# Altium schematic sheet Shared.SchDoc
size OrCAD E; SheetNumber: 1; SheetTotal: 2
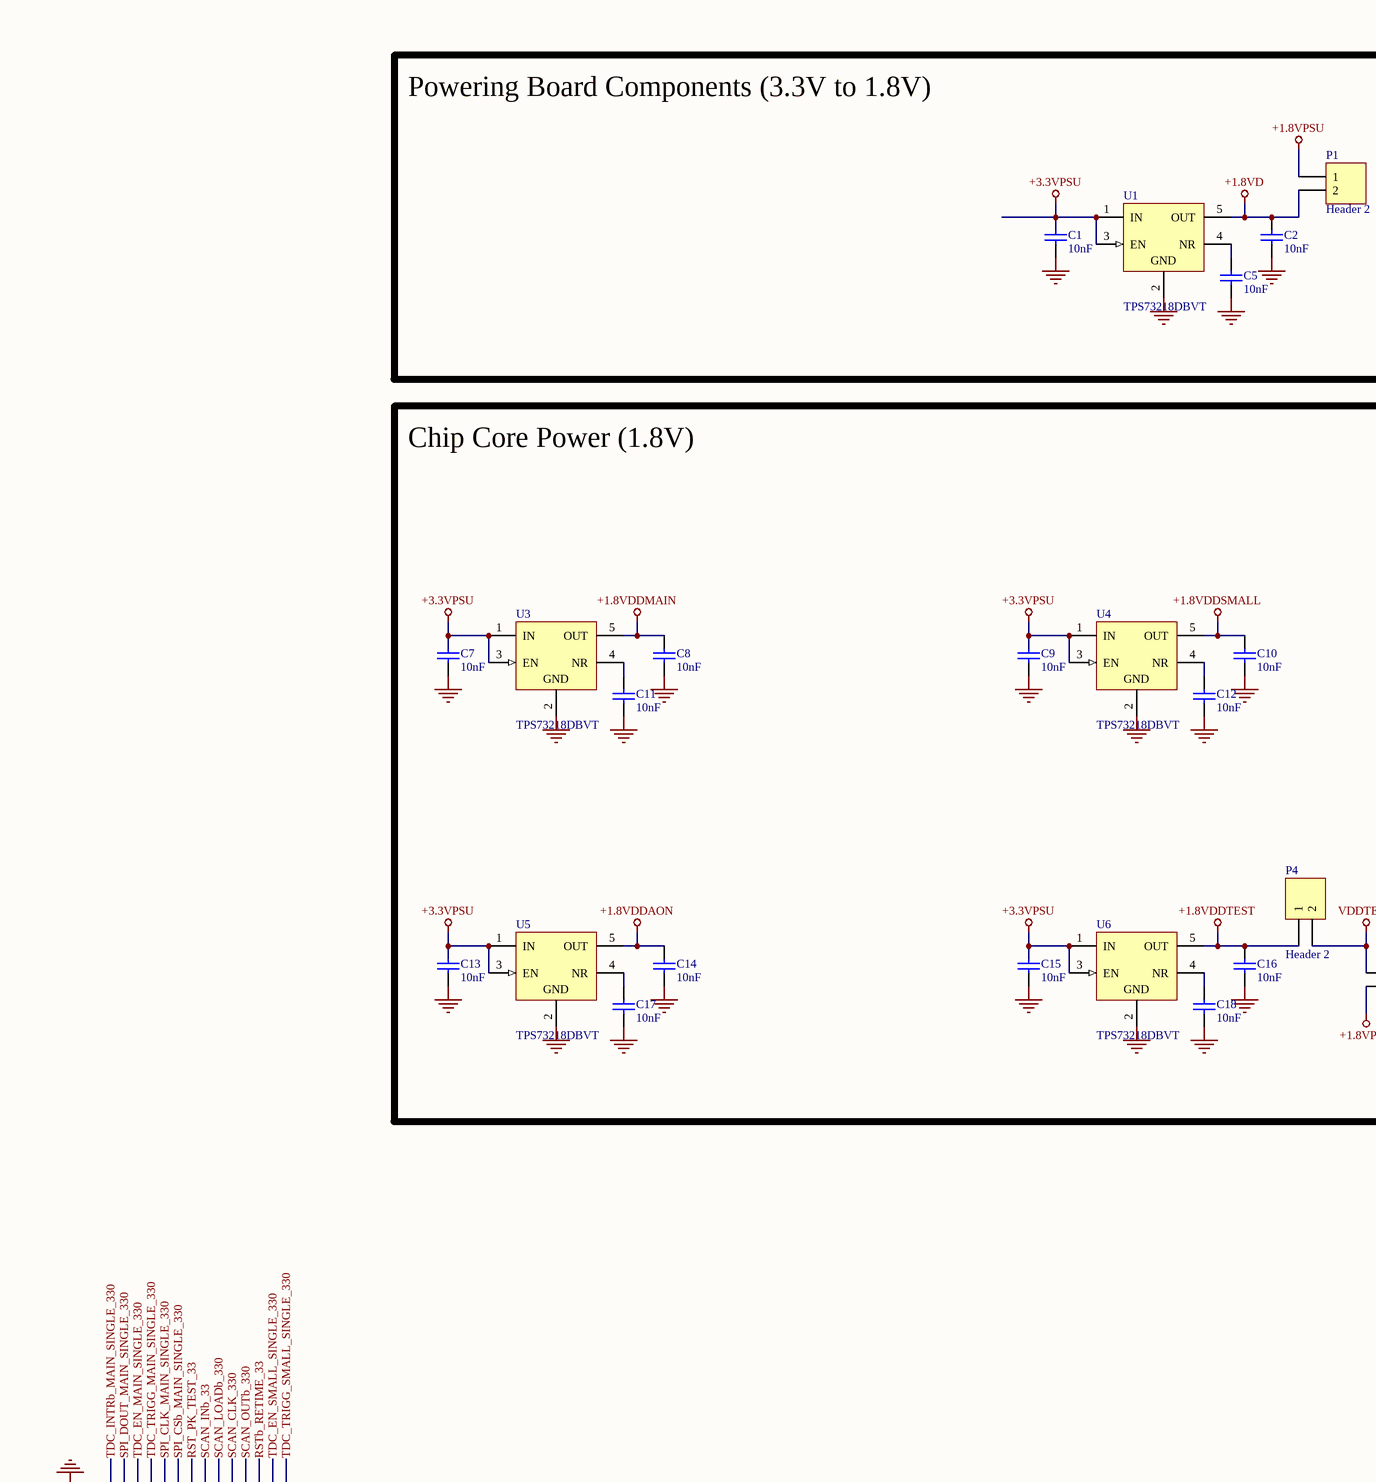
[diagram p0: Shared.SchDoc, top left]
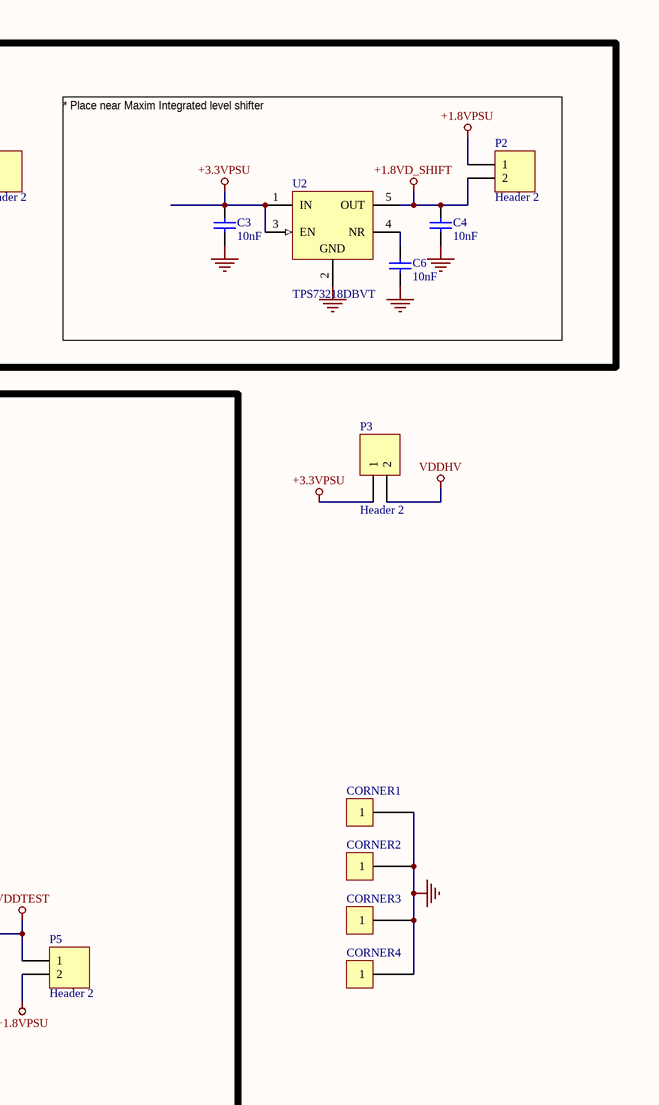
[diagram p1: Shared.SchDoc, top right]
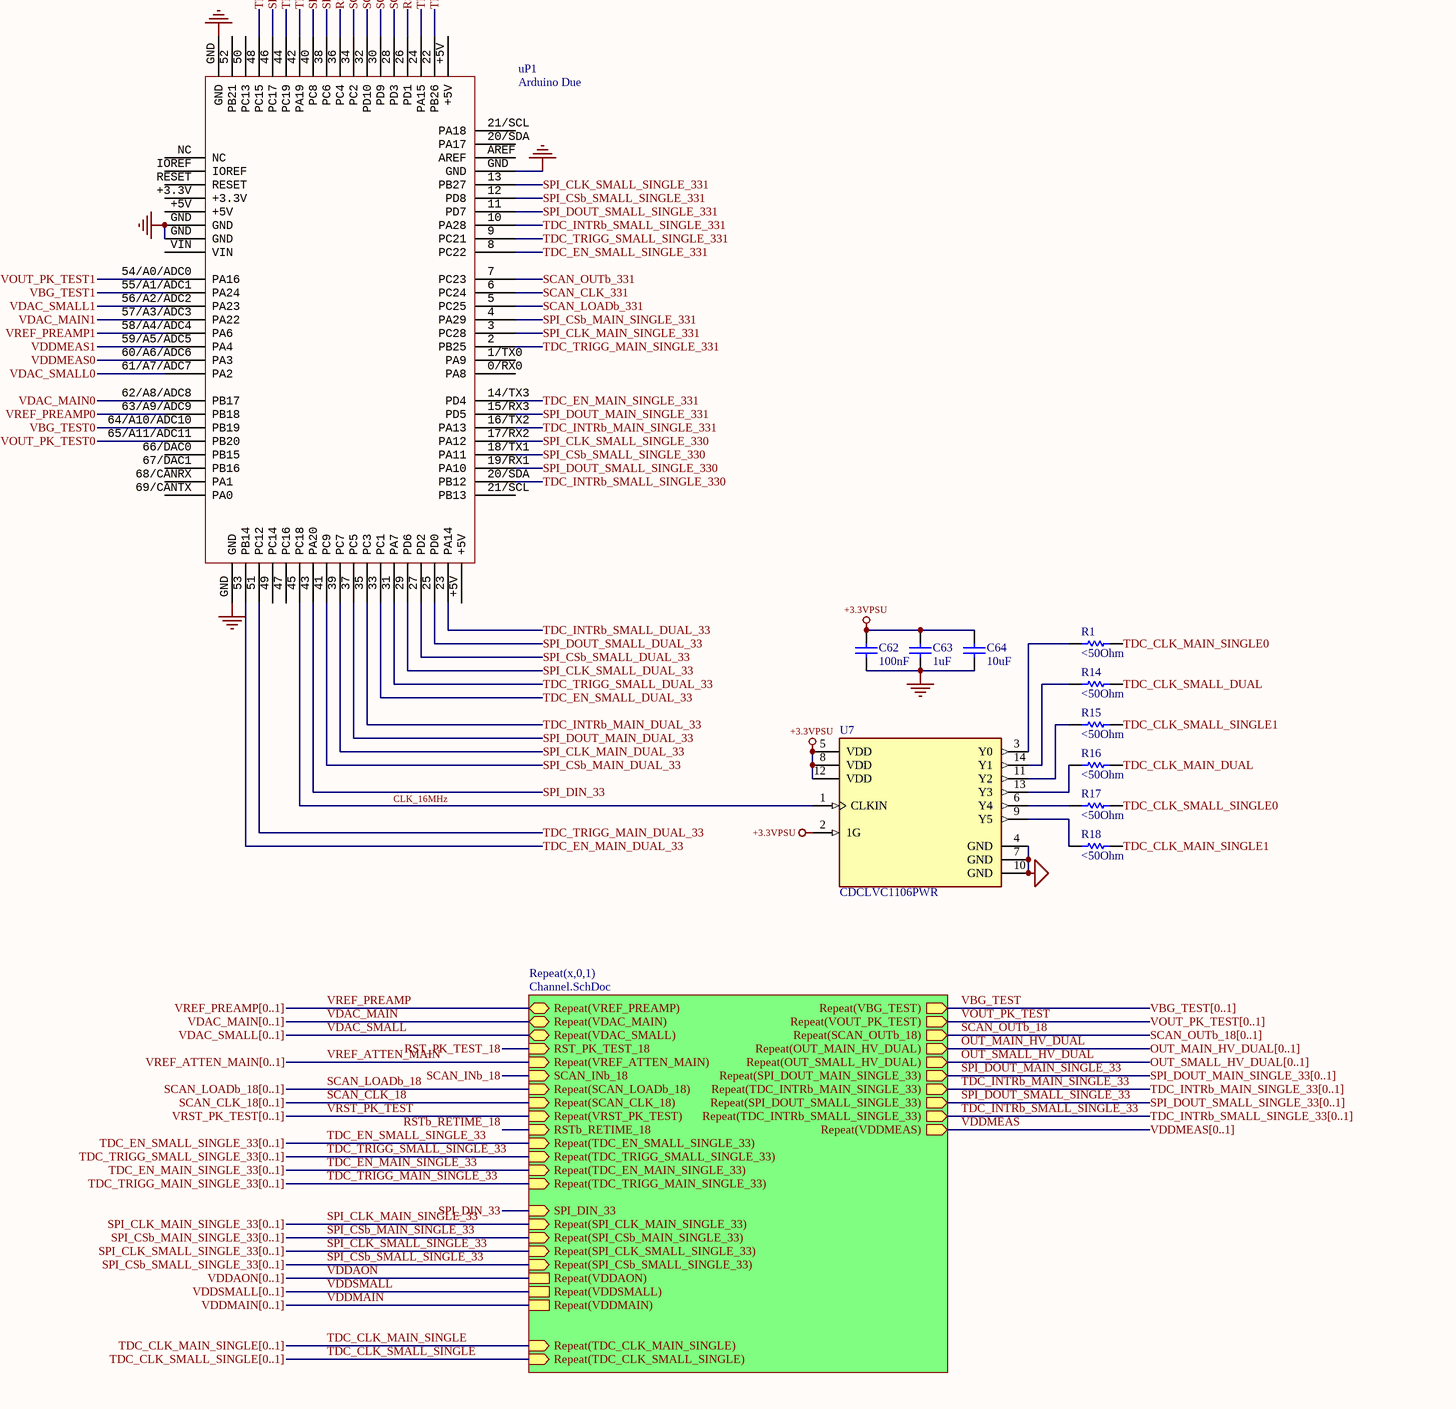
[diagram p2: Shared.SchDoc, bottom left]
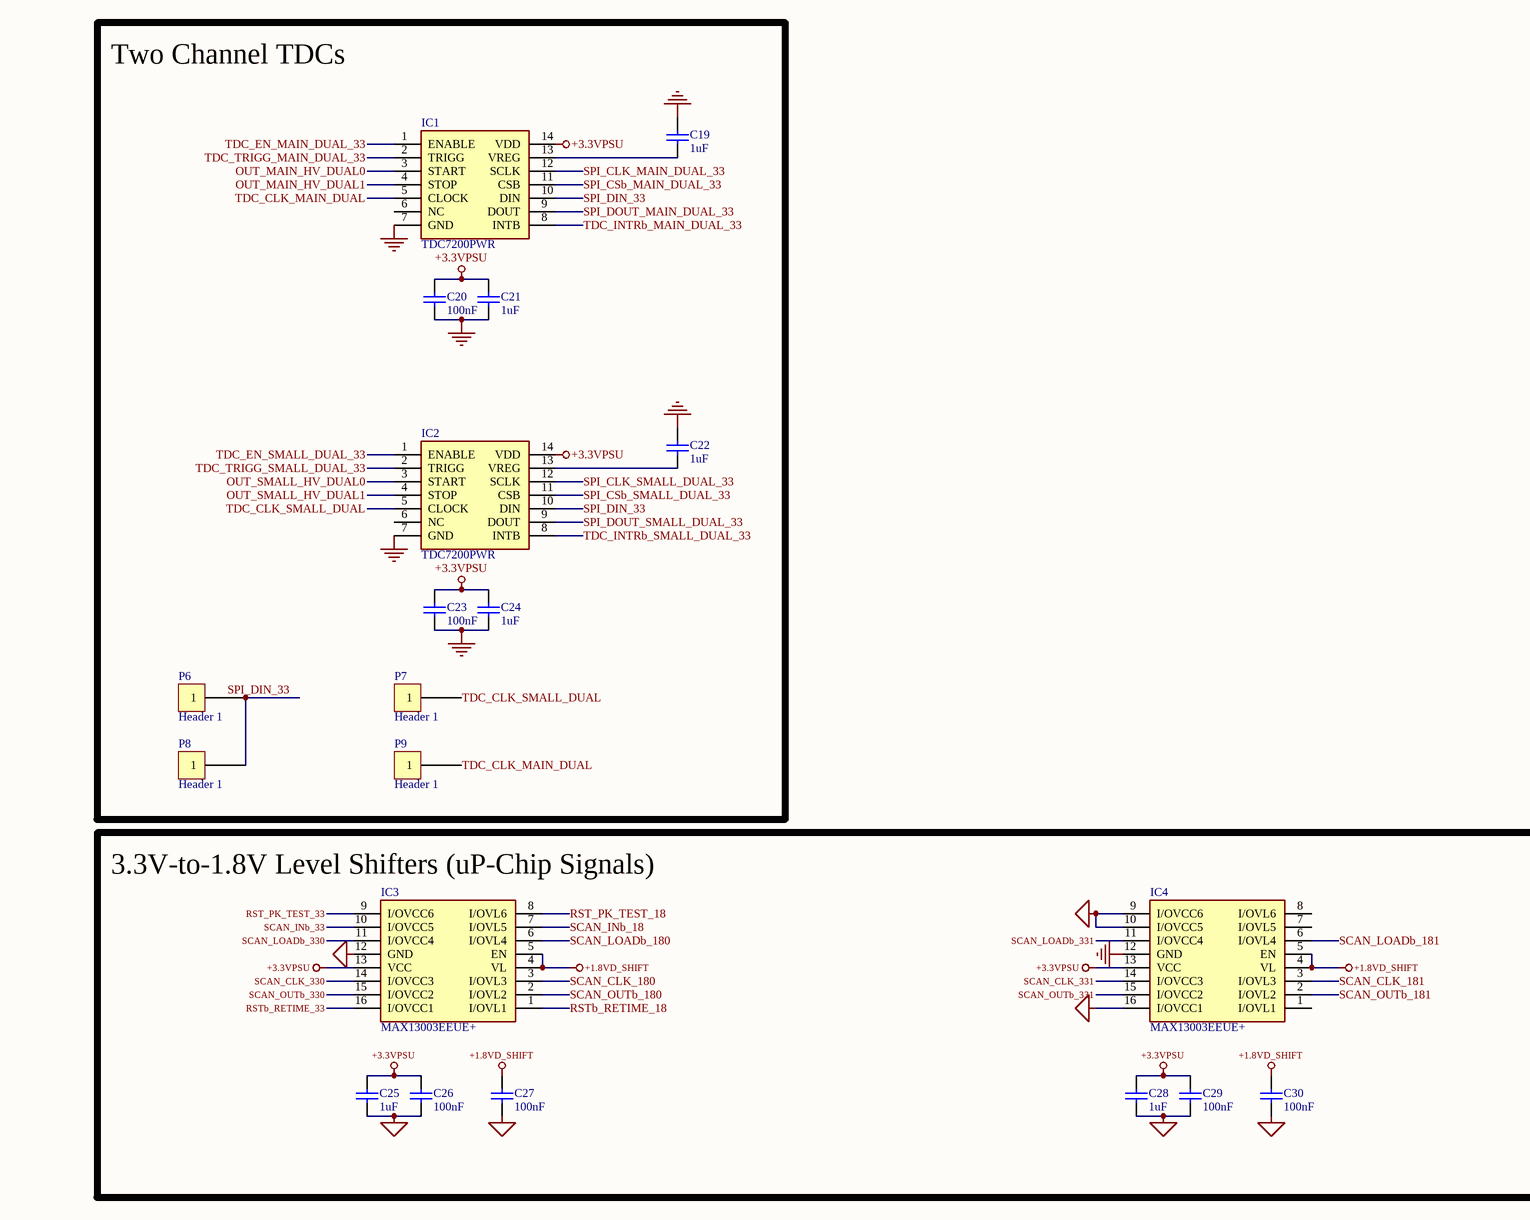
[diagram p3: Shared.SchDoc, bottom right]

## Parts
C1  10nF  [CAPC1608X90X35ML10T15]
C2  10nF  [CAPC1608X90X35ML10T15]
C3  10nF  [CAPC1608X90X35ML10T15]
C4  10nF  [CAPC1608X90X35ML10T15]
C5  10nF  [CAPC1608X90X35ML10T15]
C6  10nF  [CAPC1608X90X35ML10T15]
C7  10nF  [CAPC1608X90X35ML10T15]
C8  10nF  [CAPC1608X90X35ML10T15]
C9  10nF  [CAPC1608X90X35ML10T15]
C10  10nF  [CAPC1608X90X35ML10T15]
C11  10nF  [CAPC1608X90X35ML10T15]
C12  10nF  [CAPC1608X90X35ML10T15]
C13  10nF  [CAPC1608X90X35ML10T15]
C14  10nF  [CAPC1608X90X35ML10T15]
C15  10nF  [CAPC1608X90X35ML10T15]
C16  10nF  [CAPC1608X90X35ML10T15]
C17  10nF  [CAPC1608X90X35ML10T15]
C18  10nF  [CAPC1608X90X35ML10T15]
C19  1uF  [CAPC1608X90X35ML10T15]
C20  100nF  [CAPC1608X90X35ML10T15]
C21  1uF  [CAPC1608X90X35ML10T15]
C22  1uF  [CAPC1608X90X35ML10T15]
C23  100nF  [CAPC1608X90X35ML10T15]
C24  1uF  [CAPC1608X90X35ML10T15]
C25  1uF  [CAPC1608X90X35ML10T15]
C26  100nF  [CAPC1608X90X35ML10T15]
C27  100nF  [CAPC1608X90X35ML10T15]
C28  1uF  [CAPC1608X90X35ML10T15]
C29  100nF  [CAPC1608X90X35ML10T15]
C30  100nF  [CAPC1608X90X35ML10T15]
C62  100nF  [CAPC1608X90X35ML10T15]
C63  1uF  [CAPC1608X90X35ML10T15]
C64  10uF  [CAPC1608X90X35ML10T15]
CORNER1  Corner Mount  [CornerMount]  (value not drawn)
CORNER2  Corner Mount  [CornerMount]  (value not drawn)
CORNER3  Corner Mount  [CornerMount]  (value not drawn)
CORNER4  Corner Mount  [CornerMount]  (value not drawn)
IC1  TDC7200PWR  [SOP65P640X120-14N]
IC2  TDC7200PWR  [SOP65P640X120-14N]
IC3  MAX13003EEUE+  [SOP65P640X110-16N]
IC4  MAX13003EEUE+  [SOP65P640X110-16N]
P1  Header 2  [HDR1X2]
P2  Header 2  [HDR1X2]
P3  Header 2  [HDR1X2]
P4  Header 2  [HDR1X2]
P5  Header 2  [HDR1X2]
P6  Header 1  [Header1]
P7  Header 1  [Header1]
P8  Header 1  [Header1]
P9  Header 1  [Header1]
R1  <50Ohm  [RESC1609X50X30NL8T20]
R14  <50Ohm  [RESC1609X50X30NL8T20]
R15  <50Ohm  [RESC1609X50X30NL8T20]
R16  <50Ohm  [RESC1609X50X30NL8T20]
R17  <50Ohm  [RESC1609X50X30NL8T20]
R18  <50Ohm  [RESC1609X50X30NL8T20]
U1  TPS73218DBVT  [DBV0005A_N]
U2  TPS73218DBVT  [DBV0005A_N]
U3  TPS73218DBVT  [DBV0005A_N]
U4  TPS73218DBVT  [DBV0005A_N]
U5  TPS73218DBVT  [DBV0005A_N]
U6  TPS73218DBVT  [DBV0005A_N]
U7  CDCLVC1106PWR  [FP-PW0014A-MFG]
uP1  Arduino Due  [Arduino Due]

## Blocks framed on the sheet
Powering Board Components (3.3V to 1.8V): C1-C6 P1 P2 U1 U2
Chip Core Power (1.8V): C7-C18 P4 P5 U3-U6
Two Channel TDCs: C19-C24 IC1 IC2 P6-P9
3.3V-to-1.8V Level Shifters (uP-Chip Signals): C25-C30 IC3 IC4

## Sub-sheets
Repeat(x,0,1) = Channel.SchDoc: Repeat(VREF_PREAMP) (bidir), Repeat(VDAC_MAIN) (bidir), Repeat(VDAC_SMALL) (bidir), RST_PK_TEST_18 (in), Repeat(VREF_ATTEN_MAIN) (in), SCAN_INb_18 (in), Repeat(SCAN_LOADb_18) (in), Repeat(VBG_TEST) (out), Repeat(VOUT_PK_TEST) (out), Repeat(SCAN_CLK_18) (in), Repeat(VRST_PK_TEST) (in), Repeat(SCAN_OUTb_18) (out), Repeat(OUT_MAIN_HV_DUAL) (out), Repeat(OUT_SMALL_HV_DUAL) (out), RSTb_RETIME_18 (in), Repeat(TDC_EN_SMALL_SINGLE_33) (in), Repeat(TDC_TRIGG_SMALL_SINGLE_33) (in), Repeat(TDC_EN_MAIN_SINGLE_33) (in), Repeat(TDC_TRIGG_MAIN_SINGLE_33) (in), SPI_DIN_33 (in), Repeat(SPI_CLK_MAIN_SINGLE_33) (in), Repeat(SPI_DOUT_MAIN_SINGLE_33) (out), Repeat(SPI_CSb_MAIN_SINGLE_33) (in), Repeat(TDC_INTRb_MAIN_SINGLE_33) (out), Repeat(SPI_CLK_SMALL_SINGLE_33) (in), Repeat(SPI_DOUT_SMALL_SINGLE_33) (out), Repeat(SPI_CSb_SMALL_SINGLE_33) (in), Repeat(TDC_INTRb_SMALL_SINGLE_33) (out), Repeat(VDDAON), Repeat(VDDSMALL), Repeat(VDDMAIN), Repeat(VDDMEAS) (out), Repeat(TDC_CLK_MAIN_SINGLE) (in), Repeat(TDC_CLK_SMALL_SINGLE) (in)

## Nets
+1.8VD: C2.1 P1.2 U1.5(OUT)
+1.8VD_SHIFT: C4.1 C27.1 C30.1 IC3.4(VL) IC3.5(EN) IC4.4(VL) IC4.5(EN) P2.2 U2.5(OUT)
+1.8VDDAON: C14.1 U5.5(OUT)
+1.8VDDMAIN: C8.1 U3.5(OUT)
+1.8VDDSMALL: C10.1 U4.5(OUT)
+1.8VDDTEST: C16.1 P4.1 U6.5(OUT)
+1.8VPSU: P1.1 P2.1 P5.2
+3.3VPSU: C1.1 C3.1 C7.1 C9.1 C13.1 C15.1 C20.1 C21.1 C23.1 C24.1 C25.2 C26.2 C28.2 C29.2 C62.1 C63.1 C64.1 IC1.14(VDD) IC2.14(VDD) IC3.13(VCC) IC4.13(VCC) P3.1 U1.1(IN) U1.3(EN) U2.1(IN) U2.3(EN) U3.1(IN) U3.3(EN) U4.1(IN) U4.3(EN) U5.1(IN) U5.3(EN) U6.1(IN) U6.3(EN) U7.2(1G) U7.5(VDD) U7.8(VDD) U7.12(VDD)
GND: C1.2 C2.2 C3.2 C4.2 C5.2 C6.2 C7.2 C8.2 C9.2 C10.2 C11.2 C12.2 C13.2 C14.2 C15.2 C16.2 C17.2 C18.2 C19.2 C20.2 C21.2 C22.2 C23.2 C24.2 C25.1 C26.1 C27.2 C28.1 C29.1 C30.2 C62.2 C63.2 C64.2 CORNER1.1 CORNER2.1 CORNER3.1 CORNER4.1 IC1.7(GND) IC2.7(GND) IC3.12(GND) IC4.9(I/OVCC6) IC4.10(I/OVCC5) IC4.12(GND) IC4.16(I/OVCC1) U1.2(GND) U2.2(GND) U3.2(GND) U4.2(GND) U5.2(GND) U6.2(GND) U7.4(GND) U7.7(GND) U7.10(GND) uP1.GND
VDDHV: P3.2
VDDTEST: P4.2 P5.1
CLK_16MHz: U7.1(CLKIN) uP1.45(PC18)
OUT_MAIN_HV_DUAL: sheet Repeat(x,0,1)/Repeat(OUT_MAIN_HV_DUAL)
OUT_MAIN_HV_DUAL0: IC1.3(START)
OUT_MAIN_HV_DUAL1: IC1.4(STOP)
OUT_SMALL_HV_DUAL: sheet Repeat(x,0,1)/Repeat(OUT_SMALL_HV_DUAL)
OUT_SMALL_HV_DUAL0: IC2.3(START)
OUT_SMALL_HV_DUAL1: IC2.4(STOP)
RST_PK_TEST_18: IC3.8(I/OVL6) ; sheet Repeat(x,0,1)/RST_PK_TEST_18
RST_PK_TEST_33: IC3.9(I/OVCC6) uP1.36(PC4)
RSTb_RETIME_18: IC3.1(I/OVL1) ; sheet Repeat(x,0,1)/RSTb_RETIME_18
RSTb_RETIME_33: IC3.16(I/OVCC1) uP1.26(PD1)
SCAN_CLK_18: sheet Repeat(x,0,1)/Repeat(SCAN_CLK_18)
SCAN_CLK_180: IC3.3(I/OVL3)
SCAN_CLK_181: IC4.3(I/OVL3)
SCAN_CLK_330: IC3.14(I/OVCC3) uP1.30(PD9)
SCAN_CLK_331: IC4.14(I/OVCC3) uP1.6(PC24)
SCAN_INb_18: IC3.7(I/OVL5) ; sheet Repeat(x,0,1)/SCAN_INb_18
SCAN_INb_33: IC3.10(I/OVCC5) uP1.34(PC2)
SCAN_LOADb_18: sheet Repeat(x,0,1)/Repeat(SCAN_LOADb_18)
SCAN_LOADb_180: IC3.6(I/OVL4)
SCAN_LOADb_181: IC4.6(I/OVL4)
SCAN_LOADb_330: IC3.11(I/OVCC4) uP1.32(PD10)
SCAN_LOADb_331: IC4.11(I/OVCC4) uP1.5(PC25)
SCAN_OUTb_18: sheet Repeat(x,0,1)/Repeat(SCAN_OUTb_18)
SCAN_OUTb_180: IC3.2(I/OVL2)
SCAN_OUTb_181: IC4.2(I/OVL2)
SCAN_OUTb_330: IC3.15(I/OVCC2) uP1.28(PD3)
SCAN_OUTb_331: IC4.15(I/OVCC2) uP1.7(PC23)
SPI_CLK_MAIN_DUAL_33: IC1.12(SCLK) uP1.39(PC7)
SPI_CLK_MAIN_SINGLE_33: sheet Repeat(x,0,1)/Repeat(SPI_CLK_MAIN_SINGLE_33)
SPI_CLK_MAIN_SINGLE_330: uP1.40(PC8)
SPI_CLK_MAIN_SINGLE_331: uP1.3(PC28)
SPI_CLK_SMALL_DUAL_33: IC2.12(SCLK) uP1.29(PD6)
SPI_CLK_SMALL_SINGLE_33: sheet Repeat(x,0,1)/Repeat(SPI_CLK_SMALL_SINGLE_33)
SPI_CLK_SMALL_SINGLE_330: uP1.17/RX2(PA12)
SPI_CLK_SMALL_SINGLE_331: uP1.13(PB27)
SPI_CSb_MAIN_DUAL_33: IC1.11(CSB) uP1.41(PC9)
SPI_CSb_MAIN_SINGLE_33: sheet Repeat(x,0,1)/Repeat(SPI_CSb_MAIN_SINGLE_33)
SPI_CSb_MAIN_SINGLE_330: uP1.38(PC6)
SPI_CSb_MAIN_SINGLE_331: uP1.4(PA29)
SPI_CSb_SMALL_DUAL_33: IC2.11(CSB) uP1.27(PD2)
SPI_CSb_SMALL_SINGLE_33: sheet Repeat(x,0,1)/Repeat(SPI_CSb_SMALL_SINGLE_33)
SPI_CSb_SMALL_SINGLE_330: uP1.18/TX1(PA11)
SPI_CSb_SMALL_SINGLE_331: uP1.12(PD8)
SPI_DIN_33: IC1.10(DIN) IC2.10(DIN) P6.1 P8.1 uP1.43(PA20) ; sheet Repeat(x,0,1)/SPI_DIN_33
SPI_DOUT_MAIN_DUAL_33: IC1.9(DOUT) uP1.37(PC5)
SPI_DOUT_MAIN_SINGLE_33: sheet Repeat(x,0,1)/Repeat(SPI_DOUT_MAIN_SINGLE_33)
SPI_DOUT_MAIN_SINGLE_330: uP1.46(PC17)
SPI_DOUT_MAIN_SINGLE_331: uP1.15/RX3(PD5)
SPI_DOUT_SMALL_DUAL_33: IC2.9(DOUT) uP1.25(PD0)
SPI_DOUT_SMALL_SINGLE_33: sheet Repeat(x,0,1)/Repeat(SPI_DOUT_SMALL_SINGLE_33)
SPI_DOUT_SMALL_SINGLE_330: uP1.19/RX1(PA10)
SPI_DOUT_SMALL_SINGLE_331: uP1.11(PD7)
TDC_CLK_MAIN_DUAL: IC1.5(CLOCK) P9.1 R16.1
TDC_CLK_MAIN_SINGLE: sheet Repeat(x,0,1)/Repeat(TDC_CLK_MAIN_SINGLE)
TDC_CLK_MAIN_SINGLE0: R1.1
TDC_CLK_MAIN_SINGLE1: R18.1
TDC_CLK_SMALL_DUAL: IC2.5(CLOCK) P7.1 R14.1
TDC_CLK_SMALL_SINGLE: sheet Repeat(x,0,1)/Repeat(TDC_CLK_SMALL_SINGLE)
TDC_CLK_SMALL_SINGLE0: R17.1
TDC_CLK_SMALL_SINGLE1: R15.1
TDC_EN_MAIN_DUAL_33: IC1.1(ENABLE) uP1.53(PB14)
TDC_EN_MAIN_SINGLE_33: sheet Repeat(x,0,1)/Repeat(TDC_EN_MAIN_SINGLE_33)
TDC_EN_MAIN_SINGLE_330: uP1.44(PC19)
TDC_EN_MAIN_SINGLE_331: uP1.14/TX3(PD4)
TDC_EN_SMALL_DUAL_33: IC2.1(ENABLE) uP1.33(PC1)
TDC_EN_SMALL_SINGLE_33: sheet Repeat(x,0,1)/Repeat(TDC_EN_SMALL_SINGLE_33)
TDC_EN_SMALL_SINGLE_330: uP1.24(PA15)
TDC_EN_SMALL_SINGLE_331: uP1.8(PC22)
TDC_INTRb_MAIN_DUAL_33: IC1.8(INTB) uP1.35(PC3)
TDC_INTRb_MAIN_SINGLE_33: sheet Repeat(x,0,1)/Repeat(TDC_INTRb_MAIN_SINGLE_33)
TDC_INTRb_MAIN_SINGLE_330: uP1.48(PC15)
TDC_INTRb_MAIN_SINGLE_331: uP1.16/TX2(PA13)
TDC_INTRb_SMALL_DUAL_33: IC2.8(INTB) uP1.23(PA14)
TDC_INTRb_SMALL_SINGLE_33: sheet Repeat(x,0,1)/Repeat(TDC_INTRb_SMALL_SINGLE_33)
TDC_INTRb_SMALL_SINGLE_330: uP1.20/SDA(PA17)
TDC_INTRb_SMALL_SINGLE_331: uP1.10(PA28)
TDC_TRIGG_MAIN_DUAL_33: IC1.2(TRIGG) uP1.51(PC12)
TDC_TRIGG_MAIN_SINGLE_33: sheet Repeat(x,0,1)/Repeat(TDC_TRIGG_MAIN_SINGLE_33)
TDC_TRIGG_MAIN_SINGLE_330: uP1.42(PA19)
TDC_TRIGG_MAIN_SINGLE_331: uP1.2(PB25)
TDC_TRIGG_SMALL_DUAL_33: IC2.2(TRIGG) uP1.31(PA7)
TDC_TRIGG_SMALL_SINGLE_33: sheet Repeat(x,0,1)/Repeat(TDC_TRIGG_SMALL_SINGLE_33)
TDC_TRIGG_SMALL_SINGLE_330: uP1.22(PB26)
TDC_TRIGG_SMALL_SINGLE_331: uP1.9(PC21)
VBG_TEST: sheet Repeat(x,0,1)/Repeat(VBG_TEST)
VBG_TEST0: uP1.64/A10/ADC10(PB19)
VBG_TEST1: uP1.55/A1/ADC1(PA24)
VDAC_MAIN: sheet Repeat(x,0,1)/Repeat(VDAC_MAIN)
VDAC_MAIN0: uP1.62/A8/ADC8(PB17)
VDAC_MAIN1: uP1.57/A3/ADC3(PA22)
VDAC_SMALL: sheet Repeat(x,0,1)/Repeat(VDAC_SMALL)
VDAC_SMALL0: uP1.61/A7/ADC7(PA2)
VDAC_SMALL1: uP1.56/A2/ADC2(PA23)
VDDAON: sheet Repeat(x,0,1)/Repeat(VDDAON)
VDDMAIN: sheet Repeat(x,0,1)/Repeat(VDDMAIN)
VDDMEAS: sheet Repeat(x,0,1)/Repeat(VDDMEAS)
VDDMEAS0: uP1.60/A6/ADC6(PA3)
VDDMEAS1: uP1.59/A5/ADC5(PA4)
VDDSMALL: sheet Repeat(x,0,1)/Repeat(VDDSMALL)
VOUT_PK_TEST: sheet Repeat(x,0,1)/Repeat(VOUT_PK_TEST)
VOUT_PK_TEST0: uP1.65/A11/ADC11(PB20)
VOUT_PK_TEST1: uP1.54/A0/ADC0(PA16)
VREF_ATTEN_MAIN: sheet Repeat(x,0,1)/Repeat(VREF_ATTEN_MAIN)
VREF_PREAMP: sheet Repeat(x,0,1)/Repeat(VREF_PREAMP)
VREF_PREAMP0: uP1.63/A9/ADC9(PB18)
VREF_PREAMP1: uP1.58/A4/ADC4(PA6)
VRST_PK_TEST: sheet Repeat(x,0,1)/Repeat(VRST_PK_TEST)
NetC5_1: C5.1 U1.4(NR)
NetC6_1: C6.1 U2.4(NR)
NetC11_1: C11.1 U3.4(NR)
NetC12_1: C12.1 U4.4(NR)
NetC17_1: C17.1 U5.4(NR)
NetC18_1: C18.1 U6.4(NR)
NetC19_1: C19.1 IC1.13(VREG)
NetC22_1: C22.1 IC2.13(VREG)
NetR1_2: R1.2 U7.3(Y0)
NetR14_2: R14.2 U7.14(Y1)
NetR15_2: R15.2 U7.11(Y2)
NetR16_2: R16.2 U7.13(Y3)
NetR17_2: R17.2 U7.6(Y4)
NetR18_2: R18.2 U7.9(Y5)

Not connected (* = marked no-connect by the designer): IC1 6(NC); IC2 6(NC); IC4 1(I/OVL1) 7(I/OVL5) 8(I/OVL6); uP1 0/RX0(PA8) 1/TX0(PA9) 21/SCL(PA18) 47(PC16) 49(PC14) 50(PC13) 52(PB21) 66/DAC0(PB15) 67/DAC1(PB16) 68/CANRX(PA1) 69/CANTX(PA0) +3.3V +5V AREF IOREF NC RESET VIN

## Buses and harness runs
bus OUT_MAIN_HV_DUAL[0..1]
bus OUT_SMALL_HV_DUAL[0..1]
bus SCAN_CLK_18[0..1]
bus SCAN_LOADb_18[0..1]
bus SCAN_OUTb_18[0..1]
bus SPI_CLK_MAIN_SINGLE_33[0..1]
bus SPI_CLK_SMALL_SINGLE_33[0..1]
bus SPI_CSb_MAIN_SINGLE_33[0..1]
bus SPI_CSb_SMALL_SINGLE_33[0..1]
bus SPI_DOUT_MAIN_SINGLE_33[0..1]
bus SPI_DOUT_SMALL_SINGLE_33[0..1]
bus TDC_CLK_MAIN_SINGLE[0..1]
bus TDC_CLK_SMALL_SINGLE[0..1]
bus TDC_EN_MAIN_SINGLE_33[0..1]
bus TDC_EN_SMALL_SINGLE_33[0..1]
bus TDC_INTRb_MAIN_SINGLE_33[0..1]
bus TDC_INTRb_SMALL_SINGLE_33[0..1]
bus TDC_TRIGG_MAIN_SINGLE_33[0..1]
bus TDC_TRIGG_SMALL_SINGLE_33[0..1]
bus VBG_TEST[0..1]
bus VDAC_MAIN[0..1]
bus VDAC_SMALL[0..1]
bus VDDAON[0..1]
bus VDDMAIN[0..1]
bus VDDMEAS[0..1]
bus VDDSMALL[0..1]
bus VOUT_PK_TEST[0..1]
bus VREF_ATTEN_MAIN[0..1]
bus VREF_PREAMP[0..1]
bus VRST_PK_TEST[0..1]

## Notes on the sheet
- * Place near Maxim Integrated level shifter

## Library data of the parts
C1-C18 = CMP-2000-04945-1: 0603,10nF; Manufacturer: Murata; Capacitance: 22pF; Tolerance (%): ±5%; Rated Voltage: 50V; Dielectric: C0G; Manufacturer URL: http://www.murata.com/; Datasheet Version: Jul-06; Package Reference: 603; Case Size/Dimension: 0603; Package Description: 2-Pin Surface Mount Device, Body 1.6 x 0.8 mm; Datasheet URL: https://datasheet.ciiva.com/11786/0900766b807a1cab-11786398.pdf
C19 C21 C22 C24 C25 C28 C63 = CMP-2000-04945-1: 0603,1uF; Manufacturer: Murata; Capacitance: 22pF; Tolerance (%): ±5%; Rated Voltage: 50V; Dielectric: C0G; Manufacturer URL: http://www.murata.com/; Datasheet Version: Jul-06; Package Reference: 603; Case Size/Dimension: 0603; Package Description: 2-Pin Surface Mount Device, Body 1.6 x 0.8 mm; Datasheet URL: https://datasheet.ciiva.com/11786/0900766b807a1cab-11786398.pdf
C20 C23 C26 C27 C29 C30 C62 = CMP-2000-04945-1: 0603,100nF; Manufacturer: Murata; Capacitance: 22pF; Tolerance (%): ±5%; Rated Voltage: 50V; Dielectric: C0G; Manufacturer URL: http://www.murata.com/; Datasheet Version: Jul-06; Package Reference: 603; Case Size/Dimension: 0603; Package Description: 2-Pin Surface Mount Device, Body 1.6 x 0.8 mm; Datasheet URL: https://datasheet.ciiva.com/11786/0900766b807a1cab-11786398.pdf
C64 = CMP-2000-04945-1: 0603,10uF; Manufacturer: Murata; Capacitance: 22pF; Tolerance (%): ±5%; Rated Voltage: 50V; Dielectric: C0G; Manufacturer URL: http://www.murata.com/; Datasheet Version: Jul-06; Package Reference: 603; Case Size/Dimension: 0603; Package Description: 2-Pin Surface Mount Device, Body 1.6 x 0.8 mm; Datasheet URL: https://datasheet.ciiva.com/11786/0900766b807a1cab-11786398.pdf
IC1 IC2 = TDC7200PWR: Integrated Circuit; Manufacturer_Name: Texas Instruments; Datasheet Link: http://www.ti.com/lit/gpn/tdc7200; Height: 1.2mm; Manufacturer_Part_Number: TDC7200PWR
IC3 IC4 = MAX13003EEUE+: Integrated Circuit; Manufacturer_Name: Maxim Integrated; Datasheet Link: https://pdfserv.maximintegrated.com/en/ds/MAX13000E-MAX13005E.pdf; Height: 1.1mm; Manufacturer_Part_Number: MAX13003EEUE+
P1-P5 = Header 2: Header, 2-Pin; LatestRevisionDate: 17-Jul-2002; LatestRevisionNote: Re-released for DXP Platform.; Publisher: Altium Limited
R1 R14-R18 = CMP-2000-03816-5: 0603,<50Ohm; Manufacturer: Vishay Semiconductor; Voltage Rating: 75 V; Package Quantity: 5000; DatasheetVersion: 06/2012; Min Operating Temperature: -55 degC; ComponentLink1URL: http://www.vishay.com/; Mounting Technology: Surface Mount; Height: 0.45 mm; ComponentLink1Description: Manufacturer URL; REACH SVHC: Unknown; PackageReference: 0603; Packaging: Tape and Reel; Max Operating Temperature: 155 degC; Mount: Surface Mount; ComponentLink2Description: Datasheet; PackageDescription: 2-Pin Surface Mount Device, Body 1.575 x 0.85 mm; Length: 1.55 mm; ComponentLink2URL: http://www.vishay.com/docs/20035/dcrcwe3.pdf; Pins: 2; RoHSCompliant: true
U1-U6 = CMP-0394-00378-2: Single Output Fast Transient Response LDO, 200 mA, Fixed 1.8 V Output, 1.7 to 5.5 V Input, with Reverse Current Protection, 5-pin SOT-23 (DBV), -40 to 85 degC, Green (RoHS & no Sb/Br); Manufacturer: Texas Instruments; Iout(Max)(A): 0.25; Iq(Typ)(mA): 0.4; Accuracy(%): 1; Vout Adj(Min)(V): 1.8; Vdo(Typ)(mV): 40; SubFamily: Single Channel LDO; Vin(Min)(V): 1.7; Vin(Max)(V): 5.5; ComponentLink1URL: http://www.ti.com/; PartNumber: TPS73218DBVT; Eco-Plan: Green (RoHS & no Sb/Br); ComponentLink2Description: Datasheet; PackageVersion: 4073253-4/K; ComponentLink3URL: http://www.ti.com/litv/pdf/mpds018i; ComponentLink3Description: Package Specification; ComponentLink1Description: Manufacturer URL; Vout Adj(Max)(V): 1.8; Code_JEDEC: MO-178; ComponentLink2URL: http://www.ti.com/general/docs/lit/getliterature.tsp?genericPartNumber=TPS73218&fileType=pdf; DatasheetVersion: SBVS037O; Mounting Technology: Surface Mount; PackageReference: DBV0005A; PackageDescription: 5-Pin Plastic Small Outline, Body 1.60 Ãƒâ€” 2.90 mm, Pitch 0.95 mm; Fixed Output Options(V): 1.8
U7 = CMP-04855-000003-1: IC CLK BUFFER 1:6 250MHZ 14TSSOP; Manufacturer: Texas Instruments; Max Supply Voltage: 3.6V; Max Junction Temp: +125°C; Standoff Height: 0.05mm; Number Of Outputs: 6; Number Of Inputs: 1; Nominal Supply Current: 3-6mA; Propagation Delay: 2-2.6ns; Min Supply Voltage: 2.3V; Mouser Description: Clock Buffer Lo Jitter 1:6 LVCMOS Fan-out Clock Bfr; Temperature Range High: +85°C; Device Class L1: Integrated Circuits (ICs); Package: PW0014A; ComponentLink2URL: http://www.ti.com/lit/ds/symlink/cdclvc1106.pdf; Temperature: -40°C to +85°C; Device Class L3: Clock Buffers; Manufacturer Part Number: CDCLVC1106PWR; ComponentLink2Description: Datasheet; Temperature Range Low: -40°C; Category: IC; Ipc Land Pattern Name: SOP65P640X120-14; Height: 1.2mm; Device Class L2: Clock and Timing; RoHS: TRUE; Digikey Description: IC CLK BUFFER 1:6 250MHZ 14TSSOP; Number Of Elements: 1; Lead Free: Yes; Automotive: No; Octopart: https://octopart.com/cdclvc1106pwr-texas+instruments-18629865; Ambient Temperature Range Low: -40°C; Ambient Temperature Range High: +85°C
uP1 = Arduino Due: Header, 10-pin, 8-pin (4x), 18-pin dual row